# EAGLE design powermeter (EAGLE 9.3.0)
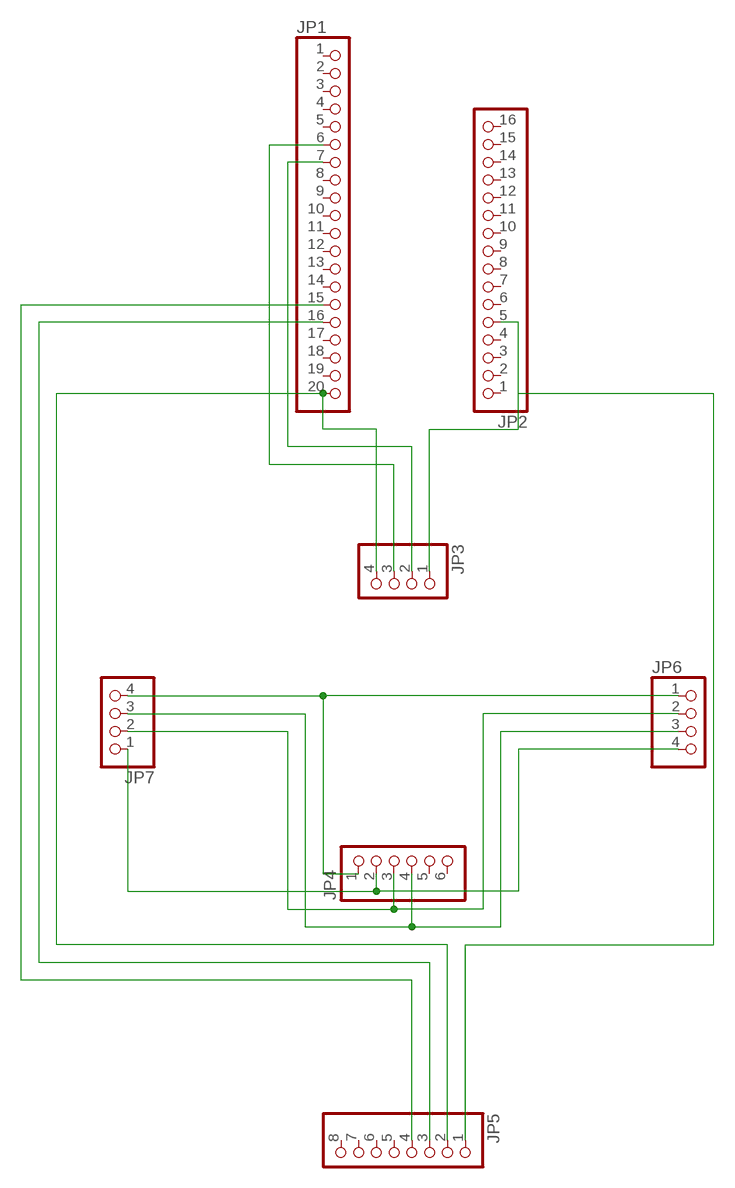
[diagram p0: schematic, sheet 1]

## Parts
JP1  PINHD-1X20  [1X20]
JP2  PINHD-1X16  [1X16]
JP3  PINHD-1X4  [1X04]
JP4  PINHD-1X6  [1X06]
JP5  PINHD-1X8  [1X08]
JP6  PINHD-1X4  [1X04]
JP7  PINHD-1X4  [1X04]

## Nets
N$1: JP4.1 JP6.1 JP7.4
N$2: JP4.2 JP6.4 JP7.1
N$3: JP4.3 JP6.2 JP7.2
N$4: JP4.4 JP6.3 JP7.3
N$5: JP1.20 JP3.4 JP5.2
N$7: JP1.6 JP3.3
N$8: JP1.7 JP3.2
N$9: JP1.15 JP5.4
N$10: JP2.5 JP3.1 JP5.1
N$11: JP1.16 JP5.3
Unconnected: JP1.1 JP1.2 JP1.3 JP1.4 JP1.5 JP1.8 JP1.9 JP1.10 JP1.11 JP1.12 JP1.13 JP1.14 JP1.17 JP1.18 JP1.19 JP2.1 JP2.2 JP2.3 JP2.4 JP2.6 JP2.7 JP2.8 JP2.9 JP2.10 JP2.11 JP2.12 JP2.13 JP2.14 JP2.15 JP2.16 JP4.5 JP4.6 JP5.5 JP5.6 JP5.7 JP5.8

## Library data of the parts
JP1 = pinhead:PINHD-1X20: PIN HEADER
JP2 = pinhead:PINHD-1X16: PIN HEADER
JP3 JP6 JP7 = pinhead:PINHD-1X4: PIN HEADER
JP4 = pinhead:PINHD-1X6: PIN HEADER
JP5 = pinhead:PINHD-1X8: PIN HEADER

## Board
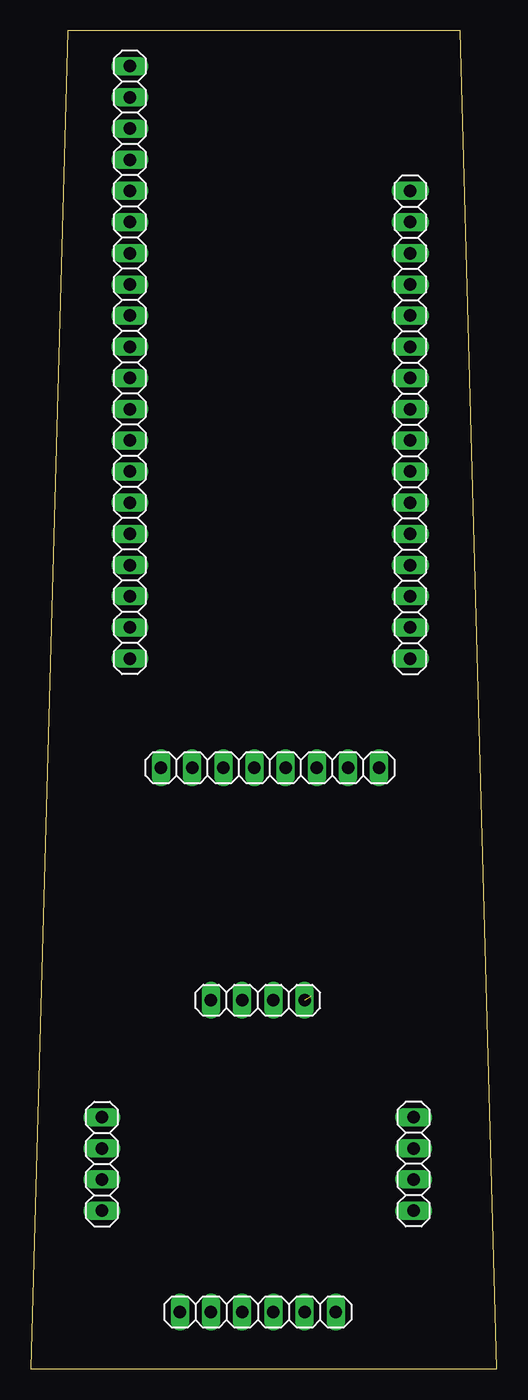
[diagram p1: board, top side]
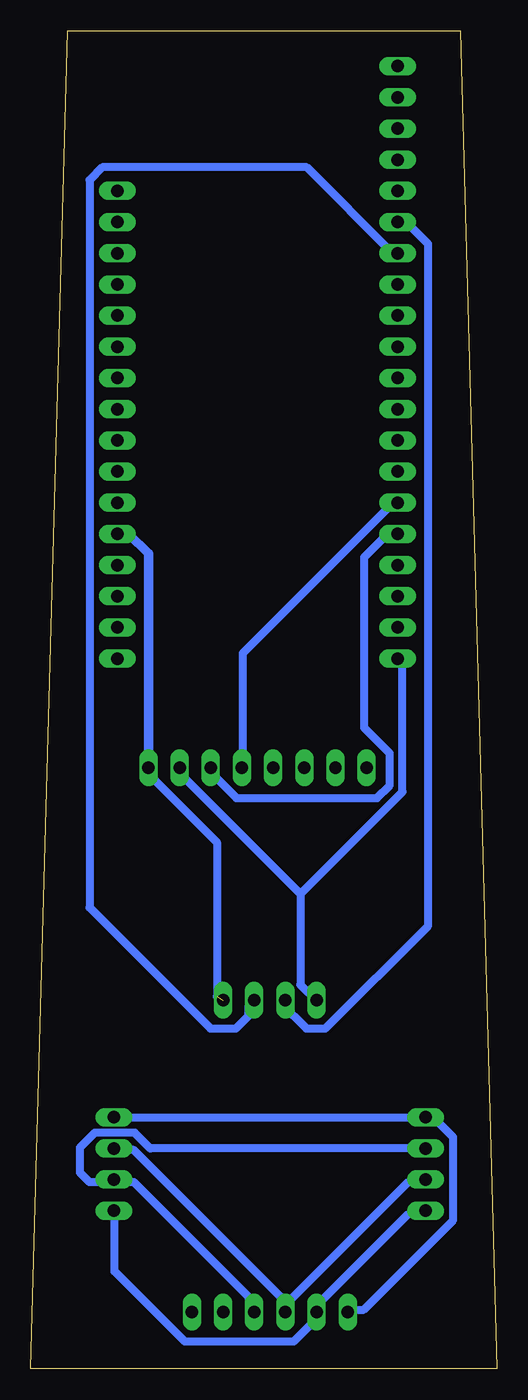
[diagram p2: board, bottom side, seen from below]

Size 38 x 109 mm. Coordinates in mm from the lower left corner, seen from the top.
Outline: 0,0 38,0 35,109 3,109 0,0
Copper layers (1*16): Top 0.035mm / dielectric 1.5mm / Bottom 0.035mm
Design rules "default *": minimum track width 25mil, minimum drill 0.35mm, track to track 16mil, track to pad 16mil, pad to pad 6mil, via to via 6mil, smd to smd 6mil, copper to edge 10mil, drill to drill 6mil, minimum pad ring 10mil, minimum via ring 8mil, stop-mask expansion 4mil, vias tented up to drill 0mil, thermal gap 10mil

### Footprints (pad centres in the part's own frame; a part is rotated, then mirrored left to right if it is on the bottom)
1X20 = drill 1.016 long: 1 -24.13,0; 2 -21.59,0; 3 -19.05,0; 4 -16.51,0; 5 -13.97,0; 6 -11.43,0; 7 -8.89,0; 8 -6.35,0; 9 -3.81,0; 10 -1.27,0; 11 1.27,0; 12 3.81,0; 13 6.35,0; 14 8.89,0; 15 11.43,0; 16 13.97,0; 17 16.51,0; 18 19.05,0; 19 21.59,0; 20 24.13,0
1X16 = drill 1.016 long: 1 -19.05,0; 2 -16.51,0; 3 -13.97,0; 4 -11.43,0; 5 -8.89,0; 6 -6.35,0; 7 -3.81,0; 8 -1.27,0; 9 1.27,0; 10 3.81,0; 11 6.35,0; 12 8.89,0; 13 11.43,0; 14 13.97,0; 15 16.51,0; 16 19.05,0
1X04 = drill 1.016 long: 1 -3.81,0; 2 -1.27,0; 3 1.27,0; 4 3.81,0
1X06 = drill 1.016 long: 1 -6.35,0; 2 -3.81,0; 3 -1.27,0; 4 1.27,0; 5 3.81,0; 6 6.35,0
1X08 = drill 1.016 long: 1 -8.89,0; 2 -6.35,0; 3 -3.81,0; 4 -1.27,0; 5 1.27,0; 6 3.81,0; 7 6.35,0; 8 8.89,0

### Placement (x,y rotation side)
JP1  8.08,81.98 270 top
JP2  30.94,76.9 90 top
JP3  18.51,30.02 180 top
JP4  18.51,4.62 0 top
JP5  19.51,48.96 180 top
JP6  31.21,16.68 270 top
JP7  5.81,16.68 90 top

### Tracks (layer width: path | path; a pad name or v marks a point on that pad's centre or on a via)
N$1
  Bottom 0.635: JP4.1 11.89,4.81 10.85,4.81 3.56,12.1 3.56,18.87 5.12,20.43 5.64,20.43 JP7.4 6.17,20.43 31.16,20.43 JP6.1
N$2
  Bottom 0.635: JP7.1 6.17,12.62 7.21,12.62 15.02,4.81 JP4.2 14.5,4.29 16.58,2.21 25.43,2.21 31.16,7.93 31.16,12.62 JP6.4
N$3
  Bottom 0.635: 17.1,5.33 17.1,4.81 JP4.3 17.1,5.33 | 17.1,5.33 7.21,15.22 6.17,15.22 JP7.2 | 17.1,5.33 29.6,17.83 31.16,17.83 JP6.2
N$4
  Bottom 0.635: 31.16,15.22 29.6,15.22 20.22,5.85 20.22,4.81 JP4.4 | 31.16,15.22 JP6.3 | JP7.3 28.25,17.95 29.52,19.23 32.77,19.23 34,18 34,16 33.22,15.22 31.16,15.22
N$5
  Bottom 0.635: 16.02,38.67 16.02,31.29 JP3.4 | 16.02,38.67 25.91,48.57 JP5.2 | 16.02,38.67 7.69,47 7.69,57.77 JP1.20
N$7
  Bottom 0.635: JP1.6 7.69,93.18 7.17,93.18 5.6,91.62 5.6,36.09 13.98,27.72 15.54,27.72 17.62,29.8 JP3.3
N$8
  Bottom 0.635: JP1.7 8.5,90.87 15.5,97.87 32.16,97.87 33.2,96.83 33.2,37.57 23.35,27.72 21.27,27.72 20.22,28.76 20.22,29.58 JP3.2
N$9
  Bottom 0.635: JP5.4 20.7,49.04 20.7,58.29 8.73,70.27 8.36,70.27 JP1.15
N$10  (1 unrouted)
  Bottom 0.635: 22.83,30.32 22.83,42.88 28.51,48.57 JP5.1 28.51,49.09
  Bottom 0.762: JP5.1 28.4,66.4 30.01,68.01 JP2.5
N$11
  Bottom 0.635: JP1.16 8.21,67.67 9.25,67.67 10.81,66.11 10.81,52.21 8.73,50.13 8.73,47.52 9.77,46.48 21.22,46.48 23.31,48.57 JP5.3